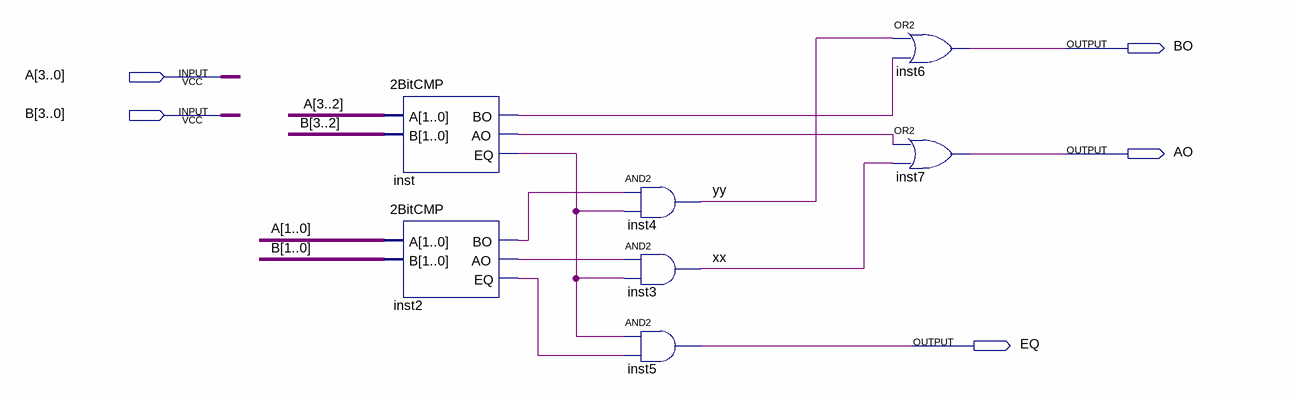
[diagram p0: schematic sheet]
// Quartus schematic 4BitCMP.bdf as structural Verilog: 7 symbols, 5 pins
module \4BitCMP  (
  input  [3:0] A,
  input  [3:0] B,
  output BO,
  output AO,
  output EQ
);

  wire inst2_ao, inst2_bo, inst2_eq, inst_ao, inst_bo, inst_eq, xx, yy;

  \2BitCMP  inst (.A(A[3:2]), .B(B[3:2]), .BO(inst_bo), .AO(inst_ao), .EQ(inst_eq));
  \2BitCMP  inst2 (.A(A[1:0]), .B(B[1:0]), .BO(inst2_bo), .AO(inst2_ao), .EQ(inst2_eq));
  and inst4 (yy, inst2_bo, inst_eq);
  and inst3 (xx, inst2_ao, inst_eq);
  and inst5 (EQ, inst_eq, inst2_eq);
  or inst6 (BO, yy, inst_bo);
  or inst7 (AO, inst_ao, xx);
endmodule
